# EAGLE schematic Main Board_old (EAGLE 9.3.1)
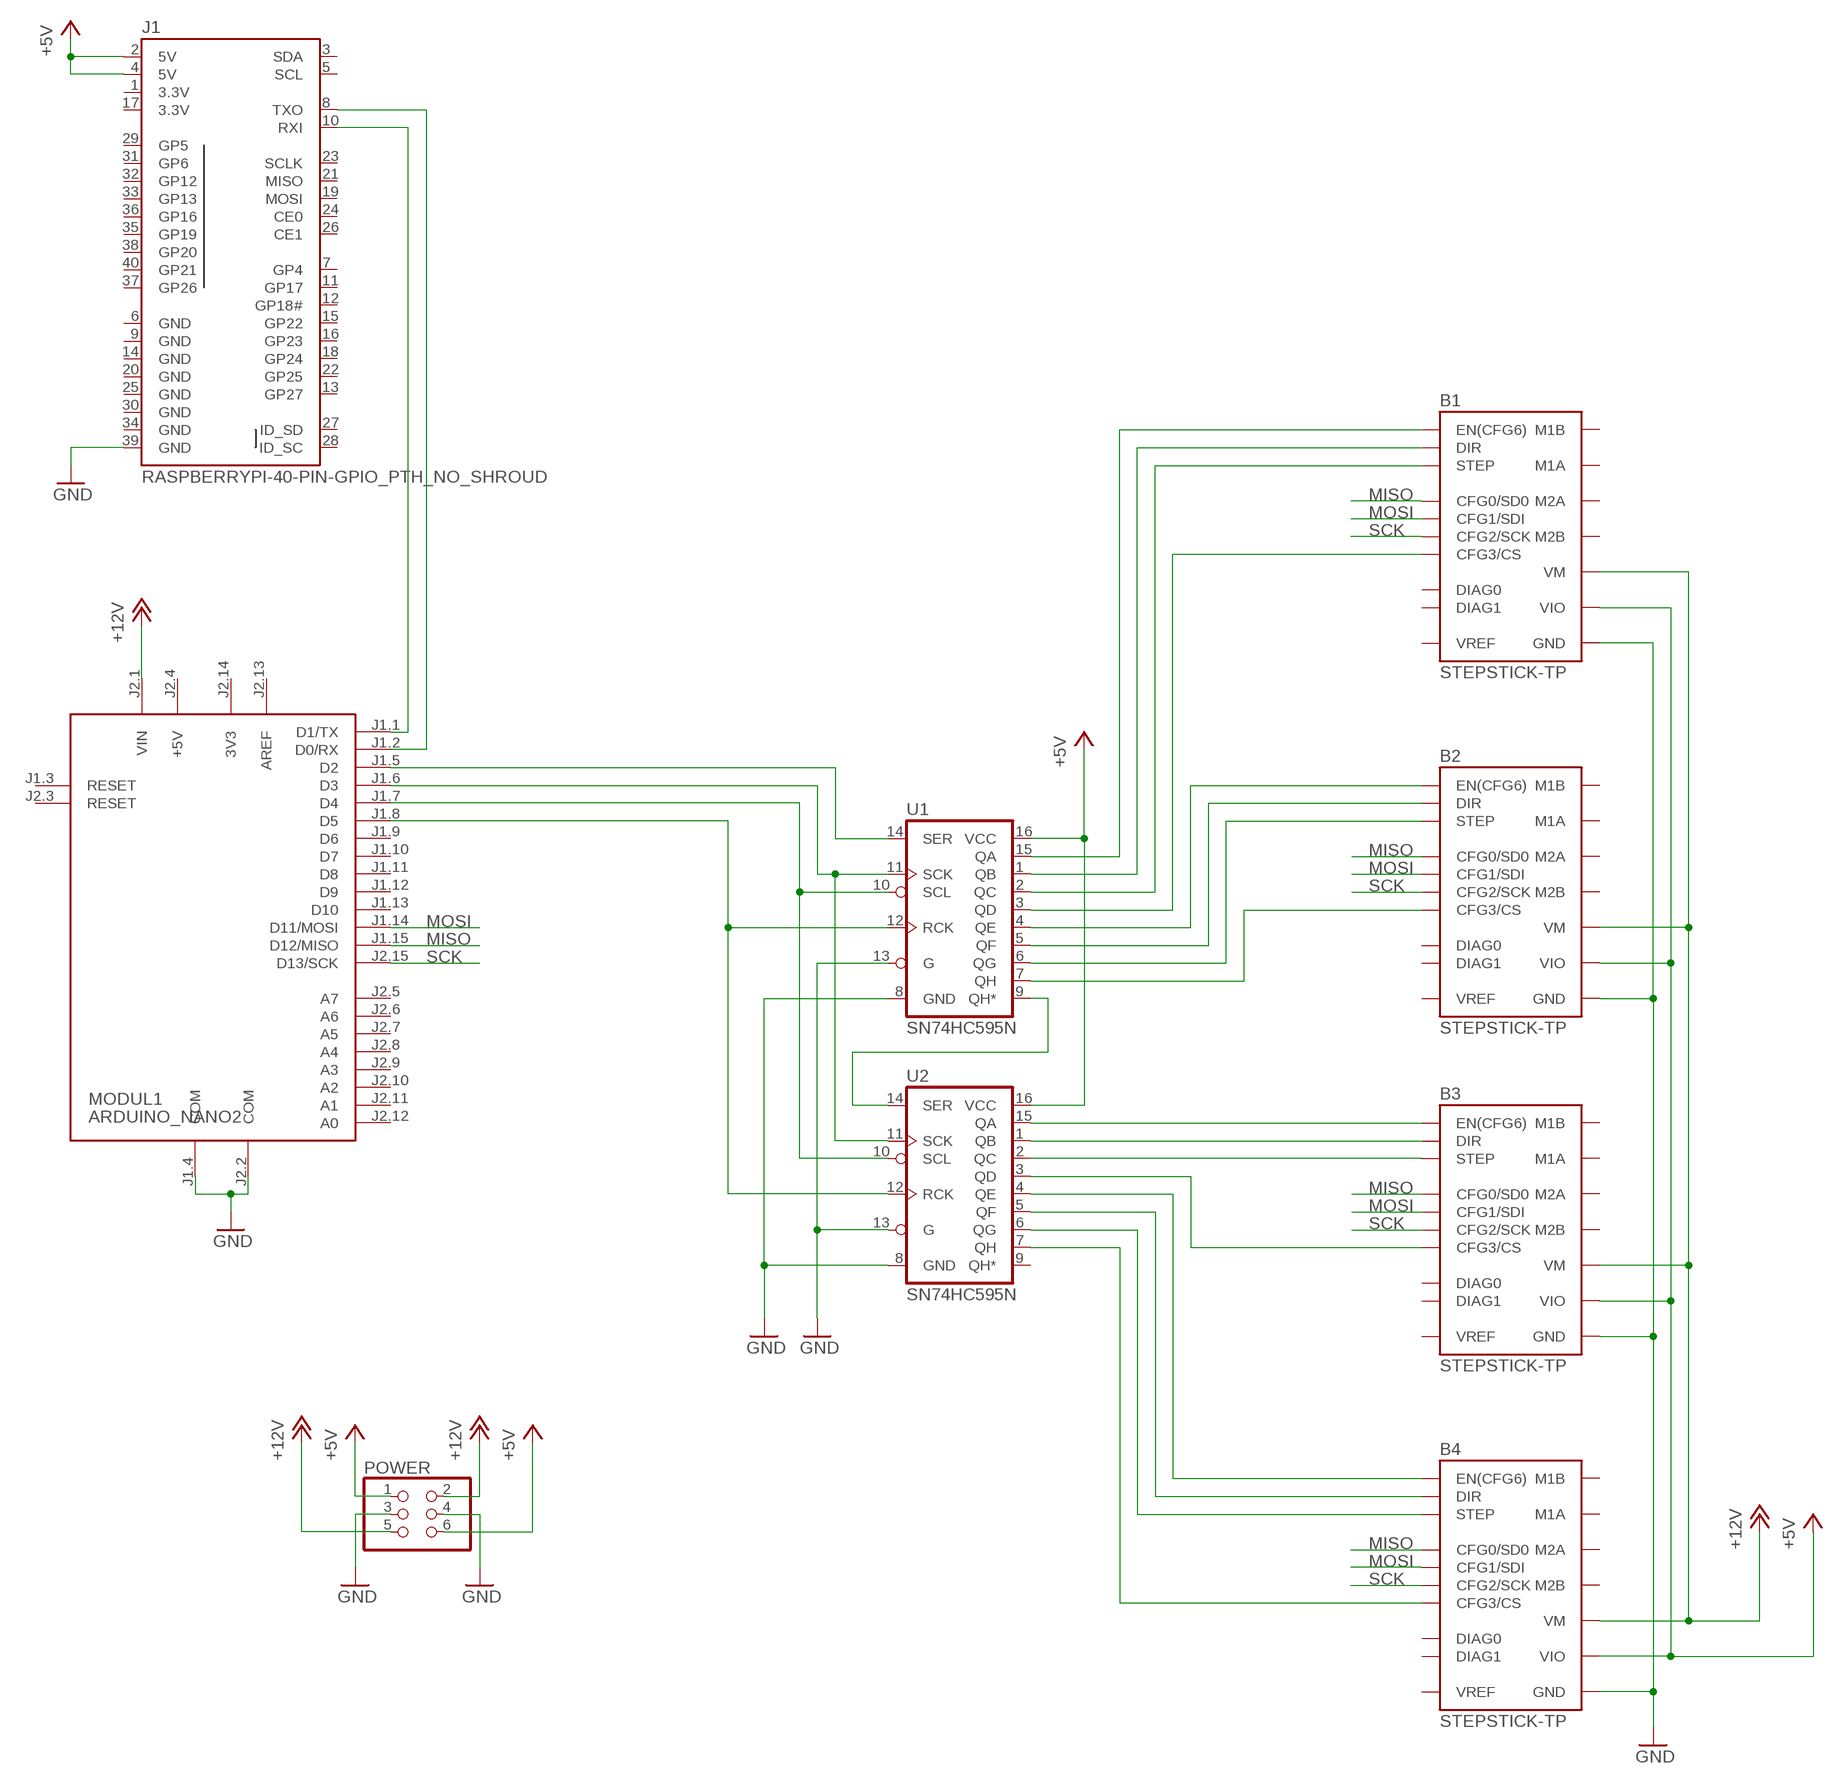
[diagram p0: schematic, sheet 1]

## Parts
B1  STEPSTICK-TP  [STEPSTICK_TP]
B2  STEPSTICK-TP  [STEPSTICK_TP]
B3  STEPSTICK-TP  [STEPSTICK_TP]
B4  STEPSTICK-TP  [STEPSTICK_TP]
J1  RASPBERRYPI-40-PIN-GPIO_PTH_NO_SHROUD  [2X20]
MODUL1  ARDUINO_NANO2  [ARDUINO_NANO2]
POWER  PINHD-2X3  [2X03]
U1  SN74HC595N  74HC595N  [DIP16]
U2  SN74HC595N  74HC595N  [DIP16]

## Nets
+5V: B1.VIO B2.VIO B3.VIO B4.VIO J1.2(5V) J1.4(5V) POWER.1 POWER.6 U1.16(VCC) U2.16(VCC)
+12V: B1.VM B2.VM B3.VM B4.VM MODUL1.J2.1(VIN) POWER.2 POWER.5
GND: B1.GND@1(GND) B1.GND@2(GND) B2.GND@1(GND) B2.GND@2(GND) B3.GND@1(GND) B3.GND@2(GND) B4.GND@1(GND) B4.GND@2(GND) J1.39(GND) MODUL1.J1.4(COM) MODUL1.J2.2(COM) POWER.3 POWER.4 U1.8(GND) U1.13(G) U2.8(GND) U2.13(G)
MISO: B1.NC/CFG0(CFG0/SD0) B2.NC/CFG0(CFG0/SD0) B3.NC/CFG0(CFG0/SD0) B4.NC/CFG0(CFG0/SD0) MODUL1.J1.15(D12/MISO)
MOSI: B1.CFG1(CFG1/SDI) B2.CFG1(CFG1/SDI) B3.CFG1(CFG1/SDI) B4.CFG1(CFG1/SDI) MODUL1.J1.14(D11/MOSI)
N$2: U1.9(QH*) U2.14(SER)
N$3: B1.EN(EN(CFG6)) U1.15(QA)
N$4: B1.DIR U1.1(QB)
N$5: B1.STEP U1.2(QC)
N$6: B1.CFG3(CFG3/CS) U1.3(QD)
N$7: B2.EN(EN(CFG6)) U1.4(QE)
N$8: B2.DIR U1.5(QF)
N$9: B2.STEP U1.6(QG)
N$10: B2.CFG3(CFG3/CS) U1.7(QH)
N$11: B4.CFG3(CFG3/CS) U2.7(QH)
N$12: B4.STEP U2.6(QG)
N$13: B4.DIR U2.5(QF)
N$14: B4.EN(EN(CFG6)) U2.4(QE)
N$15: B3.CFG3(CFG3/CS) U2.3(QD)
N$16: B3.STEP U2.2(QC)
N$17: B3.DIR U2.1(QB)
N$18: B3.EN(EN(CFG6)) U2.15(QA)
N$22: MODUL1.J1.5(D2) U1.14(SER)
N$23: MODUL1.J1.6(D3) U1.11(SCK) U2.11(SCK)
N$24: MODUL1.J1.7(D4) U1.10(SCL) U2.10(SCL)
N$25: MODUL1.J1.8(D5) U1.12(RCK) U2.12(RCK)
N$26: J1.10(RXI) MODUL1.J1.1(D1/TX)
N$27: J1.8(TXO) MODUL1.J1.2(D0/RX)
SCK: B1.CFG2(CFG2/SCK) B2.CFG2(CFG2/SCK) B3.CFG2(CFG2/SCK) B4.CFG2(CFG2/SCK) MODUL1.J2.15(D13/SCK)
Unconnected: B1.DIAG0 B1.DIAG1 B1.M1A B1.M1B B1.M2A B1.M2B B1.VREF B2.DIAG0 B2.DIAG1 B2.M1A B2.M1B B2.M2A B2.M2B B2.VREF B3.DIAG0 B3.DIAG1 B3.M1A B3.M1B B3.M2A B3.M2B B3.VREF B4.DIAG0 B4.DIAG1 B4.M1A B4.M1B B4.M2A B4.M2B B4.VREF J1.3(SDA) J1.5(SCL) J1.7(GP4) J1.11(GP17) J1.12(GP18#) J1.13(GP27) J1.15(GP22) J1.16(GP23) J1.18(GP24) J1.19(MOSI) J1.21(MISO) J1.22(GP25) J1.23(SCLK) J1.24(CE0) J1.26(CE1) J1.27(ID_SD) J1.28(ID_SC) J1.29(GP5) J1.31(GP6) J1.32(GP12) J1.33(GP13) J1.35(GP19) J1.36(GP16) J1.37(GP26) J1.38(GP20) J1.40(GP21) MODUL1.J1.3(RESET) MODUL1.J1.9(D6) MODUL1.J1.10(D7) MODUL1.J1.11(D8) MODUL1.J1.12(D9) MODUL1.J1.13(D10) MODUL1.J2.3(RESET) MODUL1.J2.5(A7) MODUL1.J2.6(A6) MODUL1.J2.7(A5) MODUL1.J2.8(A4) MODUL1.J2.9(A3) MODUL1.J2.10(A2) MODUL1.J2.11(A1) MODUL1.J2.12(A0) U2.9(QH*)

## Power pins joined to a net without a drawn wire
3.3V: J1.1(3.3V) J1.17(3.3V)
3V3: MODUL1.J2.14(3V3)
+5V: MODUL1.J2.4(+5V)
AREF: MODUL1.J2.13(AREF)
GND: J1.6(GND) J1.9(GND) J1.14(GND) J1.20(GND) J1.25(GND) J1.30(GND) J1.34(GND)

## Library data of the parts
B1-B4 = we-board:STEPSTICK: SilentStepStick - Trinamic TMC2100/TMC2130 Stepper Motor Driver TMC2100 - CFG pins for configuration TMC2130 - SPI for configuration Pin CFG0/SDO only available on TMC2130 SilentStepStick.
J1 = SparkFun-Connectors:RASPBERRYPI-40-PIN-GPIO: Raspberry Pi GPIO Header 2x20 pin connector, as found on B, B+, A+ models. Both shrouded PTH and SMT versions available. SparkFun Products: GPIO Shrouded Header <https://www.sparkfun.com/products/13054>- PTH SparkFun Pi Wedge (Preassembled) <https://www.sparkfun.com/products/13717>
MODUL1 = arduinoNano:ARDUINO_NANO2: Arduino Nano2 Auto generated by modulcreator.ulp \;; ANZAHL: 2; MODUL: TRUE; STECKX0: -76200; STECKX1: 76200; STECKY0: 177800; STECKY1: 177800
POWER = pinhead:PINHD-2X3: PIN HEADER
U1 U2 = SparkFun-IC-Logic:74*595: 8-Bit Shift Register (Serial to Parallel) Datasheet <http://cdn.sparkfun.com/datasheets/BreakoutBoards/MM74HC595.pdf> SparkFun Products SparkFun Shift Register Breakout - 74HC595 <https://www.sparkfun.com/products/10680> (BOB-10680); PROD_ID: IC-13123